# Altium schematic sheet AFE_B.SchDoc
size A
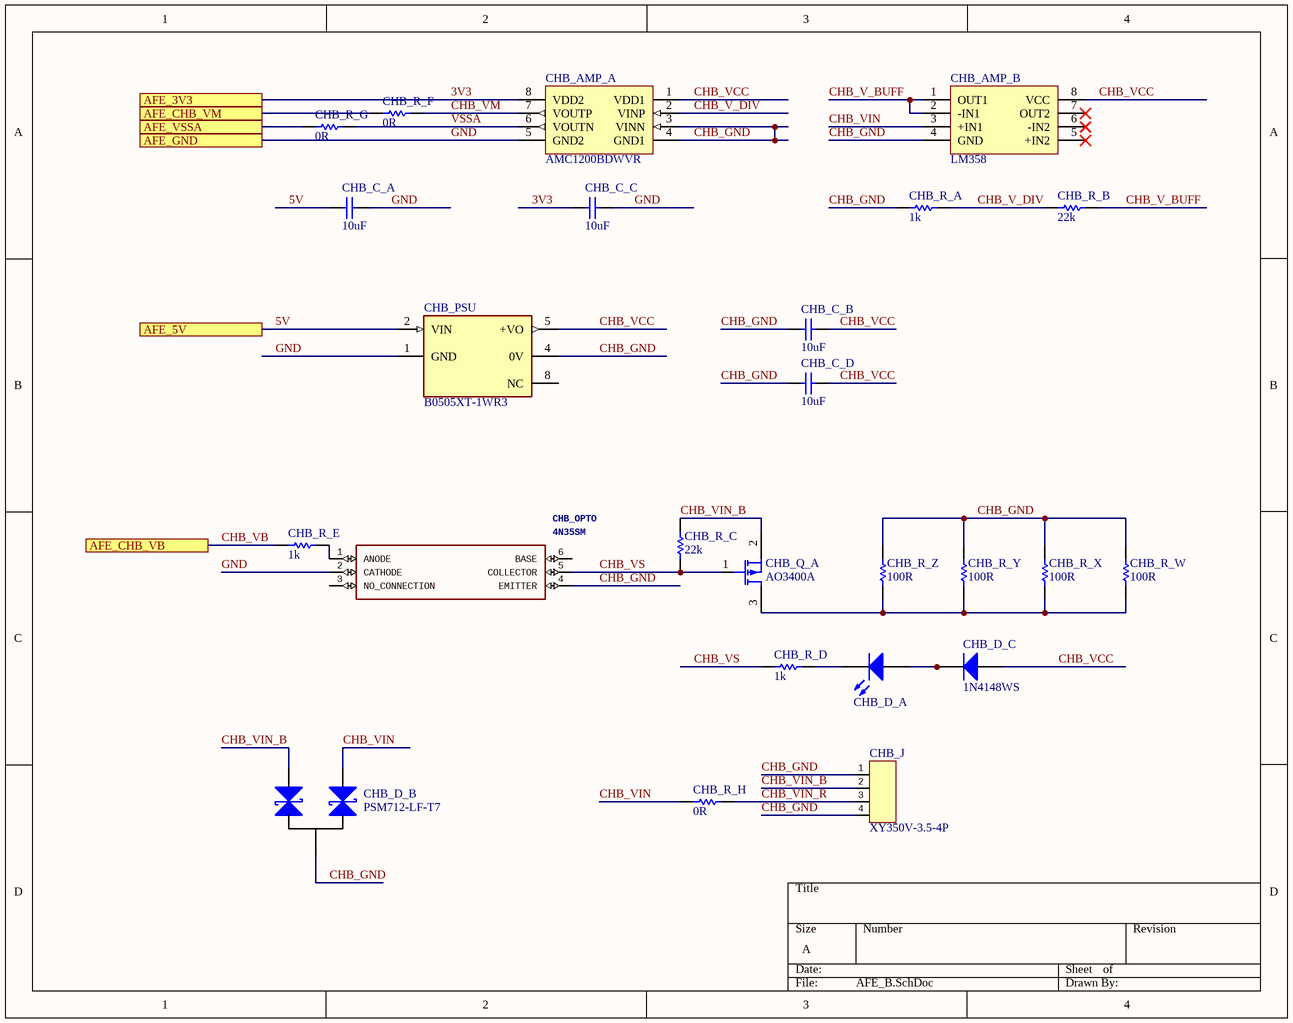
[diagram p0: AFE_B.SchDoc]

## Parts
CHB_AMP_A  AMC1200BDWVR  [SOIC-8-P1.27-W7.5]
CHB_AMP_B  LM358  [SOIC-8-P1.27-W3.5]
CHB_C_A  value 10uF  [C_0603]  (hidden comment: CL10A106MA8NRNC)
CHB_C_B  value 10uF  [C_0603]  (hidden comment: CL10A106MA8NRNC)
CHB_C_C  value 10uF  [C_0603]  (hidden comment: CL10A106MA8NRNC)
CHB_C_D  value 10uF  [C_0603]  (hidden comment: CL10A106MA8NRNC)
CHB_D_A  KT-0603R  [D_0603]  (value not drawn)
CHB_D_B  PSM712-LF-T7  [TO-236AB]
CHB_D_C  1N4148WS  [SOD-323]
CHB_J  XY350V-3.5-4P  [XY350V-3.5-4P]
CHB_OPTO  4N35SM  [SOT254P916X508-6N]
CHB_PSU  B0505XT-1WR3  [CONV_B0512XT-1WR3]
CHB_Q_A  AO3400A  [TO-236AB]
CHB_R_A  value 1k  [R_0603]  (hidden comment: 0603WAF1001T5E)
CHB_R_B  value 22k  [R_0603]  (hidden comment: 0603WAF2202T5E)
CHB_R_C  value 22k  [R_0603]  (hidden comment: 0603WAF2202T5E)
CHB_R_D  value 1k  [R_0603]  (hidden comment: 0603WAF1001T5E)
CHB_R_E  value 1k  [R_0603]  (hidden comment: 0603WAF1001T5E)
CHB_R_F  value 0R  [R_0603]  (hidden comment: 0603WAF0000T5E)
CHB_R_G  value 0R  [R_0603]  (hidden comment: 0603WAF0000T5E)
CHB_R_H  value 0R  [R_0603]  (hidden comment: 0603WAF0000T5E)
CHB_R_W  value 100R  [R_1206]  (hidden comment: 1206W4F1000T5E)
CHB_R_X  value 100R  [R_1206]  (hidden comment: 1206W4F1000T5E)
CHB_R_Y  value 100R  [R_1206]  (hidden comment: 1206W4F1000T5E)
CHB_R_Z  value 100R  [R_1206]  (hidden comment: 1206W4F1000T5E)

## Ports
AFE_3V3, AFE_5V, AFE_CHB_VB, AFE_CHB_VM, AFE_GND, AFE_VSSA

## Nets
3V3: CHB_AMP_A.8(VDD2) CHB_C_C.2 ; port AFE_3V3
5V: CHB_C_A.2 CHB_PSU.2(VIN) ; port AFE_5V
AFE_CHB_VM: CHB_R_F.1 ; port AFE_CHB_VM
AFE_VSSA: CHB_R_G.1 ; port AFE_VSSA
CHB_GND: CHB_AMP_A.3(VINN) CHB_AMP_A.4(GND1) CHB_AMP_B.4(GND) CHB_C_B.2 CHB_C_D.2 CHB_D_B.3(A) CHB_J.1 CHB_J.4 CHB_OPTO.4(EMITTER) CHB_PSU.4(0V) CHB_R_A.1 CHB_R_W.1 CHB_R_X.1 CHB_R_Y.1 CHB_R_Z.1
CHB_V_BUFF: CHB_AMP_B.1(OUT1) CHB_AMP_B.2(-IN1) CHB_R_B.2
CHB_V_DIV: CHB_AMP_A.2(VINP) CHB_R_A.2 CHB_R_B.1
CHB_VB: CHB_R_E.1 ; port AFE_CHB_VB
CHB_VCC: CHB_AMP_A.1(VDD1) CHB_AMP_B.8(VCC) CHB_C_B.1 CHB_C_D.1 CHB_D_C.2(A) CHB_PSU.5(+VO)
CHB_VIN: CHB_AMP_B.3(+IN1) CHB_D_B.2(K) CHB_R_H.1
CHB_VIN_B: CHB_D_B.1(K) CHB_J.2 CHB_Q_A.2(S) CHB_R_C.2
CHB_VIN_R: CHB_J.3 CHB_R_H.2
CHB_VM: CHB_AMP_A.7(VOUTP) CHB_R_F.2
CHB_VS: CHB_OPTO.5(COLLECTOR) CHB_Q_A.1(G) CHB_R_C.1 CHB_R_D.1
GND: CHB_AMP_A.5(GND2) CHB_C_A.1 CHB_C_C.1 CHB_OPTO.2(CATHODE) CHB_PSU.1(GND) ; port AFE_GND
VSSA: CHB_AMP_A.6(VOUTN) CHB_R_G.2
NetCHB_D_A_1: CHB_D_A.1(K) CHB_R_D.2
NetCHB_D_A_2: CHB_D_A.2(A) CHB_D_C.1(K)
NetCHB_OPTO_1: CHB_OPTO.1(ANODE) CHB_R_E.2
NetCHB_Q_A_3: CHB_Q_A.3(D) CHB_R_W.2 CHB_R_X.2 CHB_R_Y.2 CHB_R_Z.2

Not connected (* = marked no-connect by the designer): CHB_AMP_B 5(+IN2)* 6(-IN2)* 7(OUT2)*; CHB_OPTO 3(NO_CONNECTION) 6(BASE); CHB_PSU 8(NC)

## Library data of the parts
CHB_AMP_A = AMC1200BDWVR: U - IC - 100KHz ISOLATION AMPLIFIER; Speed: 100KHz; LCSC Part #: C79905; JLC Availability: Extended
CHB_AMP_B = LMV358IDR: U - IC - OP AMP (DUAL); Speed: 0.4V/us; LCSC Part #: C63813; JLC Availability: Extended
CHB_C_A CHB_C_B CHB_C_C CHB_C_D = CL10A106MA8NRNC: C - CAPACITOR - MLCC - 10uF - 25V - 0603; WVDC: 25; LCSC Part #: C96446; Availability: Basic
CHB_D_A = KT-0603R: D - LED - 0603 - Red; LCSC Part #: C2286; JLC Availability: Basic
CHB_D_B = PSM712-LF-T7: D - DIODE - TVS x2 - 7.2V; Vrrm: 7; If: 1A; LCSC Part #: C32677; JLC Availability: Basic
CHB_D_C = 1N4148WS: D - DIODE - FAST TRR - 100V - 150mA - 4ns; LCSC Part #: C2128; JLC Availability: Basic; PIV: 100V; If: 150mA; Trr: 4ns
CHB_J = XY350V-3.5-4P: J - JACK - TERMINAL - 4P - RIGHT - MALE; LCSC Part #: C557656; JLC Availability: Extended
CHB_OPTO = 4N35SM: Q - OPTOCOUPLER - 4170 V - 100% CTR; Manufacturer_Name: onsemi; GateName_1: G$1; SymbolName_1: 4N35SM; LibraryName: 4N35SM; DeviceSetName: 4N35SM; Package: SOT254P916X508-6N; LCSC Part #: C258228; Mouser_Price-Stock: https://www.mouser.co.uk/ProductDetail/onsemi-Fairchild/4N35SM?qs=VZOZQ19d7%2FIRbTYJunTCyQ%3D%3D; Manufacturer_Part_Number: 4N35SM; Height: 5.08mm
CHB_PSU = B0505XT-1WR3: T - Isolated Module DC DC Converter 5 -> 5V 200mA - DIP; MF: EVISUN; LCSC Part #: C19188495; Value: *; MP: B0505XT-1WR3; SnapEDA_Link: https://www.snapeda.com/parts/B0512XT-1WR3/MORNSUN/view-part/?ref=snap; Check_prices: https://www.snapeda.com/parts/B0512XT-1WR3/MORNSUN/view-part/?ref=eda
CHB_Q_A = AO3400A: Q - TRANSISTOR - MOSFET (P) - 20V - 3.4A - 0.26 Ohm; WVDC: 20; JLC Availability: Basic; LCSC Part #: C20917
CHB_R_A CHB_R_D CHB_R_E = 0603WAF1001T5E: R - RESISTOR - SMD - 1k - 1% - 0603; LCSC Part #: C21190; JLC Availability: Basic
CHB_R_B CHB_R_C = 0603WAF2202T5E: R - RESISTOR - SMD - 22k - 1% - 0603; LCSC Part #: C31850; JLC Availability: Basic
CHB_R_F CHB_R_G CHB_R_H = 0603WAF0000T5E: R - RESISTOR - SMD - 0R - 1% - 0603; LCSC Part #: C21189; JLC Availability: Basic
CHB_R_W CHB_R_X CHB_R_Y CHB_R_Z = 1206W4F1000T5E: R - RESISTOR - SMD - 100R - 1% - 1206; LCSC Part #: C17901; JLC Availability: Basic